# Altium schematic sheet SOM_Resets_BootConfig.SchDoc
size A4; DocumentNumber: 5; SheetNumber: 5; SheetTotal: 9
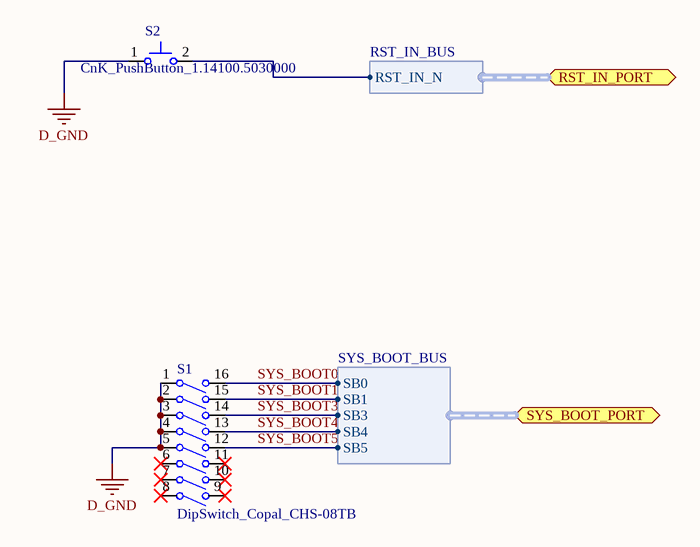
[diagram p0: SOM_Resets_BootConfig.SchDoc]

## Parts
S1  DipSwitch_Copal_CHS-08TB  [SOP127P800X250-16N_DIP_SWITCH_COPAL]
S2  CnK_PushButton_1.14100.5030000  [SOP127P600-8N_PushButtonRacon8]

## Ports
RST_IN_PORT (harness RST_IN_BUS), SYS_BOOT_PORT (harness SYS_BOOT_BUS)

## Harnesses
SYS_BOOT_BUS: SB0, SB1, SB3, SB4, SB5
RST_IN_BUS: RST_IN_N

## Nets
D_GND: S1.1(A1) S1.2(A2) S1.3(A3) S1.4(A4) S1.5(A5) S2.1
SYS_BOOT0: S1.16(B1) ; port SYS_BOOT_PORT.SB0
SYS_BOOT1: S1.15(B2) ; port SYS_BOOT_PORT.SB1
SYS_BOOT3: S1.14(B3) ; port SYS_BOOT_PORT.SB3
SYS_BOOT4: S1.13(B4) ; port SYS_BOOT_PORT.SB4
SYS_BOOT5: S1.12(B5) ; port SYS_BOOT_PORT.SB5
NetS2_2: S2.2 ; port RST_IN_PORT.RST_IN_N

Not connected (* = marked no-connect by the designer): S1 6(A6)* 7(A7)* 8(A8)* 9(B8)* 10(B7)* 11(B6)*

## Library data of the parts
S1 = A6H-8102-P: Ultra-Low Profile, Half-Pitch, SM, Slide DIP Switch, Flat Actuator, White Striker, 8 Position, SPST, Seal Tape: Embossed Taping Model; PCB_Layout: Complies with manufacturer's recommendation.; Published: 14-Mar-2008; DatasheetVersion: Jul-2007; PackageVersion: Jul-2007; PackageReference: A6H-8; Publisher: Altium Limited; PackageDescription: Slide DIP Switch; SM; 8 Position SPST; Body 11.39 x 4.5 mm (LxW); Pitch 1.27mm; ComponentLink1Description: Manufacturer Link; ComponentLink1URL: http://www.omron.com/; ComponentLink2Description: Datasheet; ComponentLink2URL: http://www.omron.com/ecb/products/pdf/en-a6h.pdf
S2 = KSS222GLFG: Switch, Subminiature Side-Actuated Tact, SMT, KSS Series, Std Actuator, 2 Gull Wing Leads, SPST, 2N Force, Gold Contact; PCB_Layout: Complies with manufacturer's recommendation.; Published: 14-Mar-2008; DatasheetVersion: Aug-2007; PackageVersion: Aug-2007; PackageReference: KSS-2G; Publisher: Altium Limited; PackageDescription: Subminiature SMT Side Actuated Switch, Body 7 x 3.5 mm (LxW); ComponentLink1Description: Manufacturer Link; ComponentLink1URL: http://www.ck-components.com/; ComponentLink2Description: Datasheet; ComponentLink2URL: http://www.ck-components.com/media/pdf/catalogs/Tactile_Switches%5CKSS_series_Tactile_August_2007.pdf